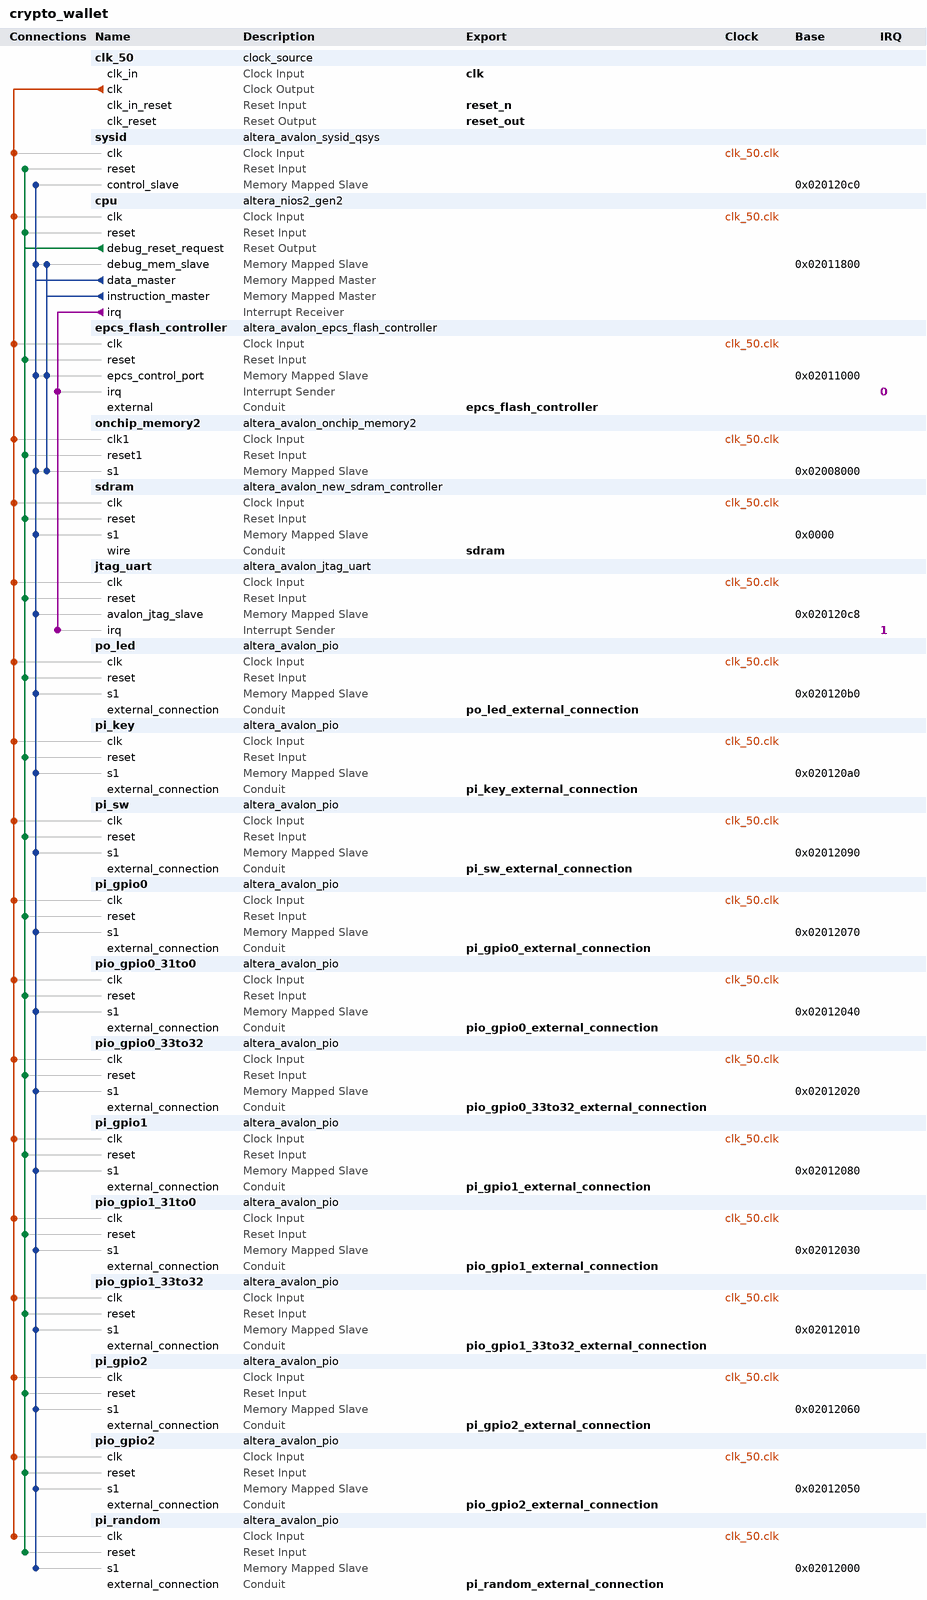
[diagram p0: system contents]
# Platform Designer (Qsys) system crypto_wallet, Cyclone IV E EP4CE22F17C6
# Parameters at their usual value, and those the tool derives, are not listed.
package require -exact qsys 18.1
create_system crypto_wallet
set_project_property DEVICE_FAMILY {Cyclone IV E}
set_project_property DEVICE EP4CE22F17C6

add_instance clk_50 clock_source 18.1
set_instance_parameter_value clk_50 clockFrequency 50000000

add_instance sysid altera_avalon_sysid_qsys 18.1
set_instance_parameter_value sysid id 0

add_instance cpu altera_nios2_gen2 18.1
set_instance_parameter_value cpu dcache_size 4096
set_instance_parameter_value cpu exceptionSlave onchip_memory2.s1
set_instance_parameter_value cpu icache_size 8192
set_instance_parameter_value cpu impl Tiny
set_instance_parameter_value cpu resetSlave onchip_memory2.s1

add_instance epcs_flash_controller altera_avalon_epcs_flash_controller 18.1
set_instance_parameter_value epcs_flash_controller resetrequest_enabled true

add_instance onchip_memory2 altera_avalon_onchip_memory2 18.1
set_instance_parameter_value onchip_memory2 dataWidth 32
set_instance_parameter_value onchip_memory2 dualPort false
set_instance_parameter_value onchip_memory2 initMemContent true
set_instance_parameter_value onchip_memory2 initializationFileName onchip_mem.hex
set_instance_parameter_value onchip_memory2 memorySize 32000

add_instance sdram altera_avalon_new_sdram_controller 18.1
set_instance_parameter_value sdram TAC 6.5
set_instance_parameter_value sdram TRCD 20.0
set_instance_parameter_value sdram TRP 20.0
set_instance_parameter_value sdram casLatency 2
set_instance_parameter_value sdram columnWidth 9
set_instance_parameter_value sdram dataWidth 16
set_instance_parameter_value sdram generateSimulationModel false
set_instance_parameter_value sdram initRefreshCommands 8
set_instance_parameter_value sdram model single_Micron_MT48LC4M32B2_7_chip
set_instance_parameter_value sdram numberOfBanks 4
set_instance_parameter_value sdram numberOfChipSelects 1
set_instance_parameter_value sdram powerUpDelay 200.0
set_instance_parameter_value sdram refreshPeriod 0.75
set_instance_parameter_value sdram rowWidth 13

add_instance jtag_uart altera_avalon_jtag_uart 18.1
set_instance_parameter_value jtag_uart simInteractiveOptions NO_INTERACTIVE_WINDOWS

add_instance po_led altera_avalon_pio 18.1
set_instance_parameter_value po_led direction Output
set_instance_parameter_value po_led width 8

add_instance pi_key altera_avalon_pio 18.1
set_instance_parameter_value pi_key direction Input
set_instance_parameter_value pi_key width 2

add_instance pi_sw altera_avalon_pio 18.1
set_instance_parameter_value pi_sw direction Input
set_instance_parameter_value pi_sw width 4

add_instance pi_gpio0 altera_avalon_pio 18.1
set_instance_parameter_value pi_gpio0 direction Input
set_instance_parameter_value pi_gpio0 width 2

add_instance pio_gpio0_31to0 altera_avalon_pio 18.1
set_instance_parameter_value pio_gpio0_31to0 direction Bidir
set_instance_parameter_value pio_gpio0_31to0 width 32

add_instance pio_gpio0_33to32 altera_avalon_pio 18.1
set_instance_parameter_value pio_gpio0_33to32 direction Bidir
set_instance_parameter_value pio_gpio0_33to32 width 2

add_instance pi_gpio1 altera_avalon_pio 18.1
set_instance_parameter_value pi_gpio1 direction Input
set_instance_parameter_value pi_gpio1 width 2

add_instance pio_gpio1_31to0 altera_avalon_pio 18.1
set_instance_parameter_value pio_gpio1_31to0 direction Bidir
set_instance_parameter_value pio_gpio1_31to0 width 32

add_instance pio_gpio1_33to32 altera_avalon_pio 18.1
set_instance_parameter_value pio_gpio1_33to32 direction Bidir
set_instance_parameter_value pio_gpio1_33to32 width 2

add_instance pi_gpio2 altera_avalon_pio 18.1
set_instance_parameter_value pi_gpio2 direction Input
set_instance_parameter_value pi_gpio2 width 3

add_instance pio_gpio2 altera_avalon_pio 18.1
set_instance_parameter_value pio_gpio2 direction Bidir
set_instance_parameter_value pio_gpio2 width 13

add_instance pi_random altera_avalon_pio 18.1
set_instance_parameter_value pi_random direction Input
set_instance_parameter_value pi_random width 32

# connections
add_connection clk_50.clk cpu.clk clock
add_connection clk_50.clk epcs_flash_controller.clk clock
add_connection clk_50.clk jtag_uart.clk clock
add_connection clk_50.clk onchip_memory2.clk1 clock
add_connection clk_50.clk pi_gpio0.clk clock
add_connection clk_50.clk pi_gpio1.clk clock
add_connection clk_50.clk pi_gpio2.clk clock
add_connection clk_50.clk pi_key.clk clock
add_connection clk_50.clk pi_random.clk clock
add_connection clk_50.clk pi_sw.clk clock
add_connection clk_50.clk pio_gpio0_31to0.clk clock
add_connection clk_50.clk pio_gpio0_33to32.clk clock
add_connection clk_50.clk pio_gpio1_31to0.clk clock
add_connection clk_50.clk pio_gpio1_33to32.clk clock
add_connection clk_50.clk pio_gpio2.clk clock
add_connection clk_50.clk po_led.clk clock
add_connection clk_50.clk sdram.clk clock
add_connection clk_50.clk sysid.clk clock
add_connection cpu.debug_reset_request cpu.reset reset
add_connection cpu.debug_reset_request epcs_flash_controller.reset reset
add_connection cpu.debug_reset_request jtag_uart.reset reset
add_connection cpu.debug_reset_request onchip_memory2.reset1 reset
add_connection cpu.debug_reset_request pi_gpio0.reset reset
add_connection cpu.debug_reset_request pi_gpio1.reset reset
add_connection cpu.debug_reset_request pi_gpio2.reset reset
add_connection cpu.debug_reset_request pi_key.reset reset
add_connection cpu.debug_reset_request pi_random.reset reset
add_connection cpu.debug_reset_request pi_sw.reset reset
add_connection cpu.debug_reset_request pio_gpio0_31to0.reset reset
add_connection cpu.debug_reset_request pio_gpio0_33to32.reset reset
add_connection cpu.debug_reset_request pio_gpio1_31to0.reset reset
add_connection cpu.debug_reset_request pio_gpio1_33to32.reset reset
add_connection cpu.debug_reset_request pio_gpio2.reset reset
add_connection cpu.debug_reset_request po_led.reset reset
add_connection cpu.debug_reset_request sdram.reset reset
add_connection cpu.debug_reset_request sysid.reset reset
add_connection cpu.data_master cpu.debug_mem_slave avalon
set_connection_parameter_value cpu.data_master/cpu.debug_mem_slave baseAddress 0x02011800
add_connection cpu.data_master epcs_flash_controller.epcs_control_port avalon
set_connection_parameter_value cpu.data_master/epcs_flash_controller.epcs_control_port baseAddress 0x02011000
add_connection cpu.data_master jtag_uart.avalon_jtag_slave avalon
set_connection_parameter_value cpu.data_master/jtag_uart.avalon_jtag_slave baseAddress 0x020120c8
add_connection cpu.data_master onchip_memory2.s1 avalon
set_connection_parameter_value cpu.data_master/onchip_memory2.s1 baseAddress 0x02008000
add_connection cpu.data_master pi_gpio0.s1 avalon
set_connection_parameter_value cpu.data_master/pi_gpio0.s1 baseAddress 0x02012070
add_connection cpu.data_master pi_gpio1.s1 avalon
set_connection_parameter_value cpu.data_master/pi_gpio1.s1 baseAddress 0x02012080
add_connection cpu.data_master pi_gpio2.s1 avalon
set_connection_parameter_value cpu.data_master/pi_gpio2.s1 baseAddress 0x02012060
add_connection cpu.data_master pi_key.s1 avalon
set_connection_parameter_value cpu.data_master/pi_key.s1 baseAddress 0x020120a0
add_connection cpu.data_master pi_random.s1 avalon
set_connection_parameter_value cpu.data_master/pi_random.s1 baseAddress 0x02012000
add_connection cpu.data_master pi_sw.s1 avalon
set_connection_parameter_value cpu.data_master/pi_sw.s1 baseAddress 0x02012090
add_connection cpu.data_master pio_gpio0_31to0.s1 avalon
set_connection_parameter_value cpu.data_master/pio_gpio0_31to0.s1 baseAddress 0x02012040
add_connection cpu.data_master pio_gpio0_33to32.s1 avalon
set_connection_parameter_value cpu.data_master/pio_gpio0_33to32.s1 baseAddress 0x02012020
add_connection cpu.data_master pio_gpio1_31to0.s1 avalon
set_connection_parameter_value cpu.data_master/pio_gpio1_31to0.s1 baseAddress 0x02012030
add_connection cpu.data_master pio_gpio1_33to32.s1 avalon
set_connection_parameter_value cpu.data_master/pio_gpio1_33to32.s1 baseAddress 0x02012010
add_connection cpu.data_master pio_gpio2.s1 avalon
set_connection_parameter_value cpu.data_master/pio_gpio2.s1 baseAddress 0x02012050
add_connection cpu.data_master po_led.s1 avalon
set_connection_parameter_value cpu.data_master/po_led.s1 baseAddress 0x020120b0
add_connection cpu.data_master sdram.s1 avalon
set_connection_parameter_value cpu.data_master/sdram.s1 baseAddress 0x0000
add_connection cpu.data_master sysid.control_slave avalon
set_connection_parameter_value cpu.data_master/sysid.control_slave baseAddress 0x020120c0
add_connection cpu.instruction_master cpu.debug_mem_slave avalon
set_connection_parameter_value cpu.instruction_master/cpu.debug_mem_slave baseAddress 0x02011800
add_connection cpu.instruction_master epcs_flash_controller.epcs_control_port avalon
set_connection_parameter_value cpu.instruction_master/epcs_flash_controller.epcs_control_port baseAddress 0x02011000
add_connection cpu.instruction_master onchip_memory2.s1 avalon
set_connection_parameter_value cpu.instruction_master/onchip_memory2.s1 baseAddress 0x02008000
add_connection cpu.irq epcs_flash_controller.irq interrupt
set_connection_parameter_value cpu.irq/epcs_flash_controller.irq irqNumber 0
add_connection cpu.irq jtag_uart.irq interrupt
set_connection_parameter_value cpu.irq/jtag_uart.irq irqNumber 1

# exported interfaces
add_interface clk clock sink
set_interface_property clk EXPORT_OF clk_50.clk_in
add_interface epcs_flash_controller conduit end
set_interface_property epcs_flash_controller EXPORT_OF epcs_flash_controller.external
add_interface pi_gpio0_external_connection conduit end
set_interface_property pi_gpio0_external_connection EXPORT_OF pi_gpio0.external_connection
add_interface pi_gpio1_external_connection conduit end
set_interface_property pi_gpio1_external_connection EXPORT_OF pi_gpio1.external_connection
add_interface pi_gpio2_external_connection conduit end
set_interface_property pi_gpio2_external_connection EXPORT_OF pi_gpio2.external_connection
add_interface pi_key_external_connection conduit end
set_interface_property pi_key_external_connection EXPORT_OF pi_key.external_connection
add_interface pi_random_external_connection conduit end
set_interface_property pi_random_external_connection EXPORT_OF pi_random.external_connection
add_interface pi_sw_external_connection conduit end
set_interface_property pi_sw_external_connection EXPORT_OF pi_sw.external_connection
add_interface pio_gpio0_33to32_external_connection conduit end
set_interface_property pio_gpio0_33to32_external_connection EXPORT_OF pio_gpio0_33to32.external_connection
add_interface pio_gpio0_external_connection conduit end
set_interface_property pio_gpio0_external_connection EXPORT_OF pio_gpio0_31to0.external_connection
add_interface pio_gpio1_33to32_external_connection conduit end
set_interface_property pio_gpio1_33to32_external_connection EXPORT_OF pio_gpio1_33to32.external_connection
add_interface pio_gpio1_external_connection conduit end
set_interface_property pio_gpio1_external_connection EXPORT_OF pio_gpio1_31to0.external_connection
add_interface pio_gpio2_external_connection conduit end
set_interface_property pio_gpio2_external_connection EXPORT_OF pio_gpio2.external_connection
add_interface po_led_external_connection conduit end
set_interface_property po_led_external_connection EXPORT_OF po_led.external_connection
add_interface reset_n reset sink
set_interface_property reset_n EXPORT_OF clk_50.clk_in_reset
add_interface reset_out reset source
set_interface_property reset_out EXPORT_OF clk_50.clk_reset
add_interface sdram conduit end
set_interface_property sdram EXPORT_OF sdram.wire

set_interconnect_requirement {$system} qsys_mm.clockCrossingAdapter HANDSHAKE
set_interconnect_requirement {$system} qsys_mm.enableEccProtection FALSE
set_interconnect_requirement {$system} qsys_mm.insertDefaultSlave FALSE
set_interconnect_requirement {$system} qsys_mm.maxAdditionalLatency 1

save_system crypto_wallet.qsys
